# Altium schematic sheet PSU.SchDoc: Power supply
size A4; Author: eldar6776@hotmail.com; DrawnBy: Eldar Dedic; Organization: PROVEN d.o.o.; Address1: Adema Buće 102; Address2: 71000 Sarajevo; Address3: Federacija BiH; Address4: Bosna i Hercegovina; DocumentNumber: CD-26514; Revision: 001; SheetNumber: 6; SheetTotal: 8; ProjectName: KONTROLER TRANSPORTA MATERIJALA
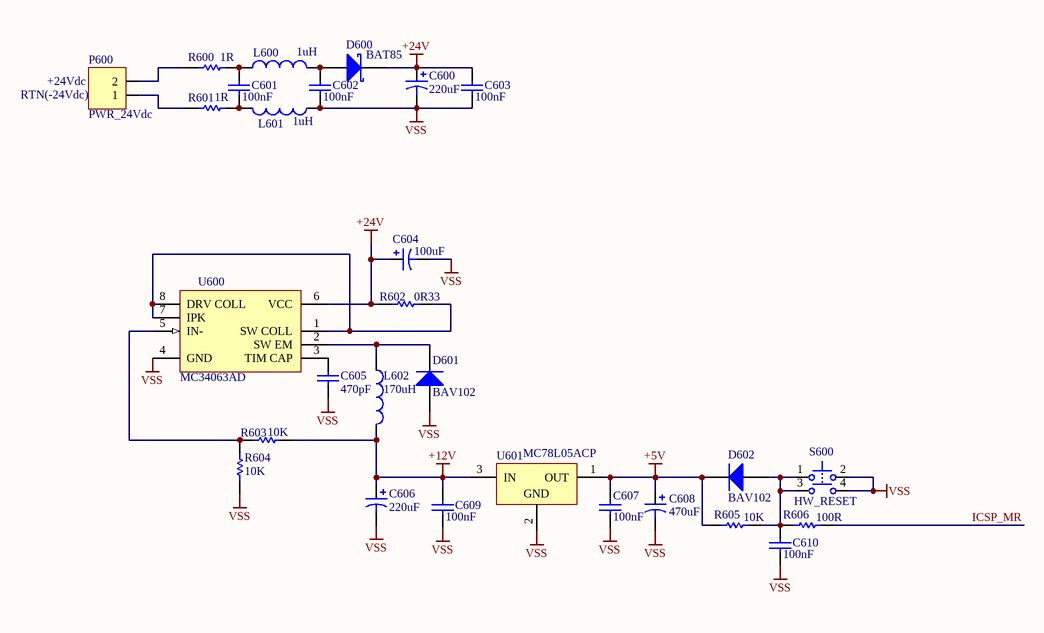
[diagram p0: PSU.SchDoc]

## Parts
C600  220uF  [E]
C601  value 100nF  [1206]
C602  value 100nF  [1206]
C603  value 100nF  [1206]
C604  100uF  [CAPPR2-5X11]
C605  value 470pF  [0805]
C606  220uF  [E]
C607  value 100nF  [1206]
C608  470uF  [CAPPR2-5X11]
C609  value 100nF  [1206]
C610  value 100nF  [1206]
D600  BAT85  [SOD68]
D601  BAV102  [SOD80C]
D602  BAV102  [SOD80C]
L600  value 1uH  [PCMC063T]
L601  value 1uH  [PCMC063T]
L602  value 170uH  [RB5-10.5]
P600  PWR_24Vdc  [TERMINAL BLOK 2]
R600  1R  [ERA-0805]
R601  1R  [ERA-0805]
R602  0R33  [ERA-0805]
R603  10K  [ERA-0805]
R604  10K  [ERA-0805]
R605  10K  [ERA-0805]
R606  100R  [ERA-0805]
S600  HW_RESET  [IT-2175]
U600  MC34063AD  [626-05]
U601  MC78L05ACP  [29-04]

## Nets
+5V: C607.2 C608.1 D602.2(K) R605.1 U601.1(OUT)
+12V: C606.1 C609.2 L602.2 R603.2 U601.3(IN)
+24V: C600.1 C603.2 C604.1 D600.2(K) R602.1 U600.6(VCC)
VSS: C600.2 C602.1 C603.1 C604.2 C605.1 C606.2 C607.1 C608.2 C609.1 C610.1 D601.1(A) L601.1 R604.1 S600.2 S600.4 U600.4(GND) U601.2(GND)
ICSP_MR: R606.2
NetC601_1: C601.1 L601.2 R601.1
NetC601_2: C601.2 L600.1 R600.1
NetC602_2: C602.2 D600.1(A) L600.2
NetC605_2: C605.2 U600.3(TIM_CAP)
NetC610_2: C610.2 D602.1(A) R605.2 R606.1 S600.1 S600.3
NetD601_2: D601.2(K) L602.1 U600.2(SW_EM)
NetP600_1: P600.1 R601.2
NetP600_2: P600.2 R600.2
NetR602_2: R602.2 U600.1(SW_COLL) U600.7(IPK) U600.8(DRV_COLL)
NetR603_1: R603.1 R604.2 U600.5(IN-)

## Notes on the sheet
- (near P600) RTN(-24Vdc)
- (near P600) +24Vdc
- Title
- Size:
- Date:
- A4
- Number:
- Time:
- Revision:
- Sheet
- of
- File:

## Library data of the parts
C600 C606 = 94SA107X0010EBP: Solid Aluminum Capacitor with Organic Semiconductor Electrolyte: 100uF, 10V, Bulk Pack; Note: Part Numbers shown are for ± 20% capacitance tolerance (X0).; PCB_Layout: Complies with Manufacturer's Recommendation.; DrillSize: Nominal, Rounded to the nearest 0.1mm; Published: 19-Mar-2004; DatasheetDocument: 29-Jun-2001; PackageReference: E; Publisher: Altium Limited; ComponentLink1Description: Manufacturer Link; ComponentLink1URL: http://www.vishay.com/; ComponentLink2Description: Datasheet; ComponentLink2URL: http://www.vishay.com/docs/90003/94sa.pdf; Value: 100uF
C601-C603 C607 C609 C610 = C1206: Ceramic Chip Capacitor - Standard; Published: 17-Jul-2002; LatestRevisionDate: 19-Mar-2004; LatestRevisionNote: Silkscreen size reduced.; DatasheetDocument: Mar-2001; PackageDocument: Mar-2001; PackageReference: 1206; Publisher: Altium Limited; Code_JEITA: 1206; Code_IPC: 3216 [1206]; ComponentLink1Description: Manufacturer Link; ComponentLink1URL: http://www.kemet.com/; ComponentLink2Description: Datasheet; ComponentLink2URL: http://www.kemet.com/kemet/web/homepage/kechome.nsf/vapubfilesname/F3102TA.pdf/$file/F3102TA.pdf
C604 C608 = EKA00AA210L00: Aluminum Electrolytic Capacitor, Radial Style with Long Leads: 10uF, 100V; Note: Refer to Manufacturer's Data Sheets for other lead formations; DrillSize: Nominal, Rounded To The Nearest 0.1mm; Published: 19-Mar-2004; DatasheetDocument: 20-Feb-2001; PackageReference: CAPPR2-5X11; Publisher: Altium Limited; ComponentLink1Description: Manufacturer Link; ComponentLink1URL: http://www.vishay.com/; ComponentLink2Description: Datasheet; ComponentLink2URL: http://www.vishay.com/docs/25014/eka.pdf; Value: 10uF
C605 = C0805: Ceramic Chip Capacitor - Standard; Note: Footprint corresponds to dimensions for bulk cassette packaging. This case size has tightened tolerances.; Published: 17-Jul-2002; LatestRevisionDate: 19-Mar-2004; LatestRevisionNote: Silkscreen size reduced.; DatasheetDocument: Mar-2001; PackageDocument: Mar-2001; PackageReference: 0805; Publisher: Altium Limited; Code_JEITA: 0805; Code_IPC: 2012[0805]; ComponentLink1Description: Manufacturer Link; ComponentLink1URL: http://www.kemet.com/; ComponentLink2Description: Datasheet; ComponentLink2URL: http://www.kemet.com/kemet/web/homepage/kechome.nsf/vapubfilesname/F3102TA.pdf/$file/F3102TA.pdf
D600 = BAT85: Schottky Barrier Diode; Published: 17-Sep-2003; DatasheetVersion: 25-May-2000; PackageVersion: May-2000; PackageReference: SOD68; Publisher: Altium Limited; PackageDescription: Diode, Axial; Body 3 x 1.6 mm (LxDia. max), Lead Dia. 0.55 mm (max); Code_JEDEC: DO-204-AG; ComponentLink1Description: Manufacturer Link; ComponentLink1URL: http://www.semiconductors.philips.com/; ComponentLink2Description: Datasheet; ComponentLink2URL: http://www.semiconductors.philips.com/acrobat/datasheets/BAT85_4.pdf
D601 D602 = BAV102: General-purpose Diode; Published: 17-Sep-2003; LatestRevisionDate: 19-Mar-2004; LatestRevisionNote: Silkscreen size reduced.; DatasheetVersion: 17-Sep-1996; PackageVersion: Jan-2002; PackageReference: SOD80C; Publisher: Altium Limited; PackageDescription: Metal Electrode Face (MELF) Diode; Body 3.5 x 1.6 mm (LxDia); ComponentLink1Description: Manufacturer Link; ComponentLink1URL: http://www.semiconductors.philips.com/; ComponentLink2Description: Datasheet; ComponentLink2URL: http://www.semiconductors.philips.com/acrobat/datasheets/BAV100_2.pdf
L600 L601 = PCMC063T-1R0MN: SMT Power Choke Coil; Size 7.3×6.6×3.0mm, ±20% Tolerance, 1.0uH, 11A; PCB_Layout: Complies with manufacturer's recommendation.; Published: 26-Sep-2008; DatasheetVersion: Oct-2007; PackageVersion: Oct-2007; PackageReference: PCMC063T; Publisher: Altium Limited; PackageDescription: SM Power Choke Coil; 2 Leads; Body 7.3 x 6.6 x 3.0 mm (LxWxH); ComponentLink1Description: Manufacturer Link; ComponentLink1URL: http://www.susumu.co.jp/; ComponentLink2Description: Datasheet; ComponentLink2URL: http://www.susumu.co.jp/english/pdf/products-j07-01.pdf
L602 = PCMC063T-R82MN: SMT Power Choke Coil; Size 7.3×6.6×3.0mm, ±20% Tolerance, 0.82uH, 13A; PCB_Layout: Complies with manufacturer's recommendation.; Published: 26-Sep-2008; DatasheetVersion: Oct-2007; PackageVersion: Oct-2007; PackageReference: PCMC063T; Publisher: Altium Limited; PackageDescription: SM Power Choke Coil; 2 Leads; Body 7.3 x 6.6 x 3.0 mm (LxWxH); ComponentLink1Description: Manufacturer Link; ComponentLink1URL: http://www.susumu.co.jp/; ComponentLink2Description: Datasheet; ComponentLink2URL: http://www.susumu.co.jp/english/pdf/products-j07-01.pdf
P600 = Terminal blok 2 pina: Terminal blok 2
R600-R606 = ERAS: Metal Film Thermosensitive Chip Resistor, 0.56 Ohm to 10k Ohm Range, 5% Tolerance, 0805 Size, 0.1 W; Note: If flow soldering, adjust pad width of PCB Footprint to 0.7 - 0.8 times the width of the resistor.; Published: 17-Dec-2003; LatestRevisionDate: 19-Mar-2004; LatestRevisionNote: Silkscreen size reduced.; PackageDocument: Mar-2003; PackageReference: ERA-0805; Publisher: Altium Limited; Code_IPC: 2012 [0805]; ComponentLink1Description: Manufacturer Link; ComponentLink1URL: http://www.panasonic.com/industrial/components/resistive_products.htm; ComponentLink2Description: Datasheet; ComponentLink2URL: http://www.panasonic.com/industrial/components/pdf/AOF0000CE1.pdf
S600 = IT-2175: Tactile Switch, DPST; Thru-Hole; Vertical; Rating DC 12V, 50mA (max); PackageDocument: Rev.0; Published: 6-Jun-2005; DatasheetDocument: Rev.0; PackageReference: IT-2175; Publisher: Altium Limited; ComponentLink1Description: Manufacturer Link; ComponentLink1URL: http://www.ilswitch.com/; ComponentLink2Description: Device Overview; ComponentLink2URL: http://www.ilswitch.com/list.php?ac_id=010112&ai_id=91
U600 = MC34063AD: DC-to-DC Converter Control Circuit; Published: 15-Apr-2002; LatestRevisionDate: 13-Apr-2006; LatestRevisionNote: IPC-7351 Footprint Added.; DatasheetVersion: 1996; PackageVersion: 1998; PackageReference: 751-05; Publisher: Altium Limited; PackageDescription: 8-Pin Small Outline Integrated Circuit 1.27 mm Pitch; Code_JEDEC: MS-012-AA; Code_IPC: SOIC127P600-8; ComponentLink1Description: Manufacturer Link; ComponentLink1URL: http://www.onsemi.com/site/products/taxonomy/0,4438,503,00.html; ComponentLink2Description: Datasheet; ComponentLink2URL: http://www.onsemi.com/pub/Collateral/MC34063A-D.PDF
U601 = MC78L05ACP: 3-Terminal Low-Current Positive Fixed Voltage Regulator; Published: 17-Jul-2002; DatasheetVersion: 1988; PackageVersion: 1996; PackageReference: 29-04; Publisher: Altium Limited; PackageDescription: TO, Flat Index; 3 In-Line, Axial Leads; Body Dia. 4.8mm; Leads 0.48 x 0.5 mm (max); ComponentLink1Description: Manufacturer Link; ComponentLink1URL: http://www.onsemi.com/site/products/taxonomy/0,4438,503,00.html; ComponentLink2Description: Datasheet; ComponentLink2URL: http://www.onsemi.com/pub/Collateral/MC78L00A-D.PDF